# EAGLE design povsheild (EAGLE 6.5.0)
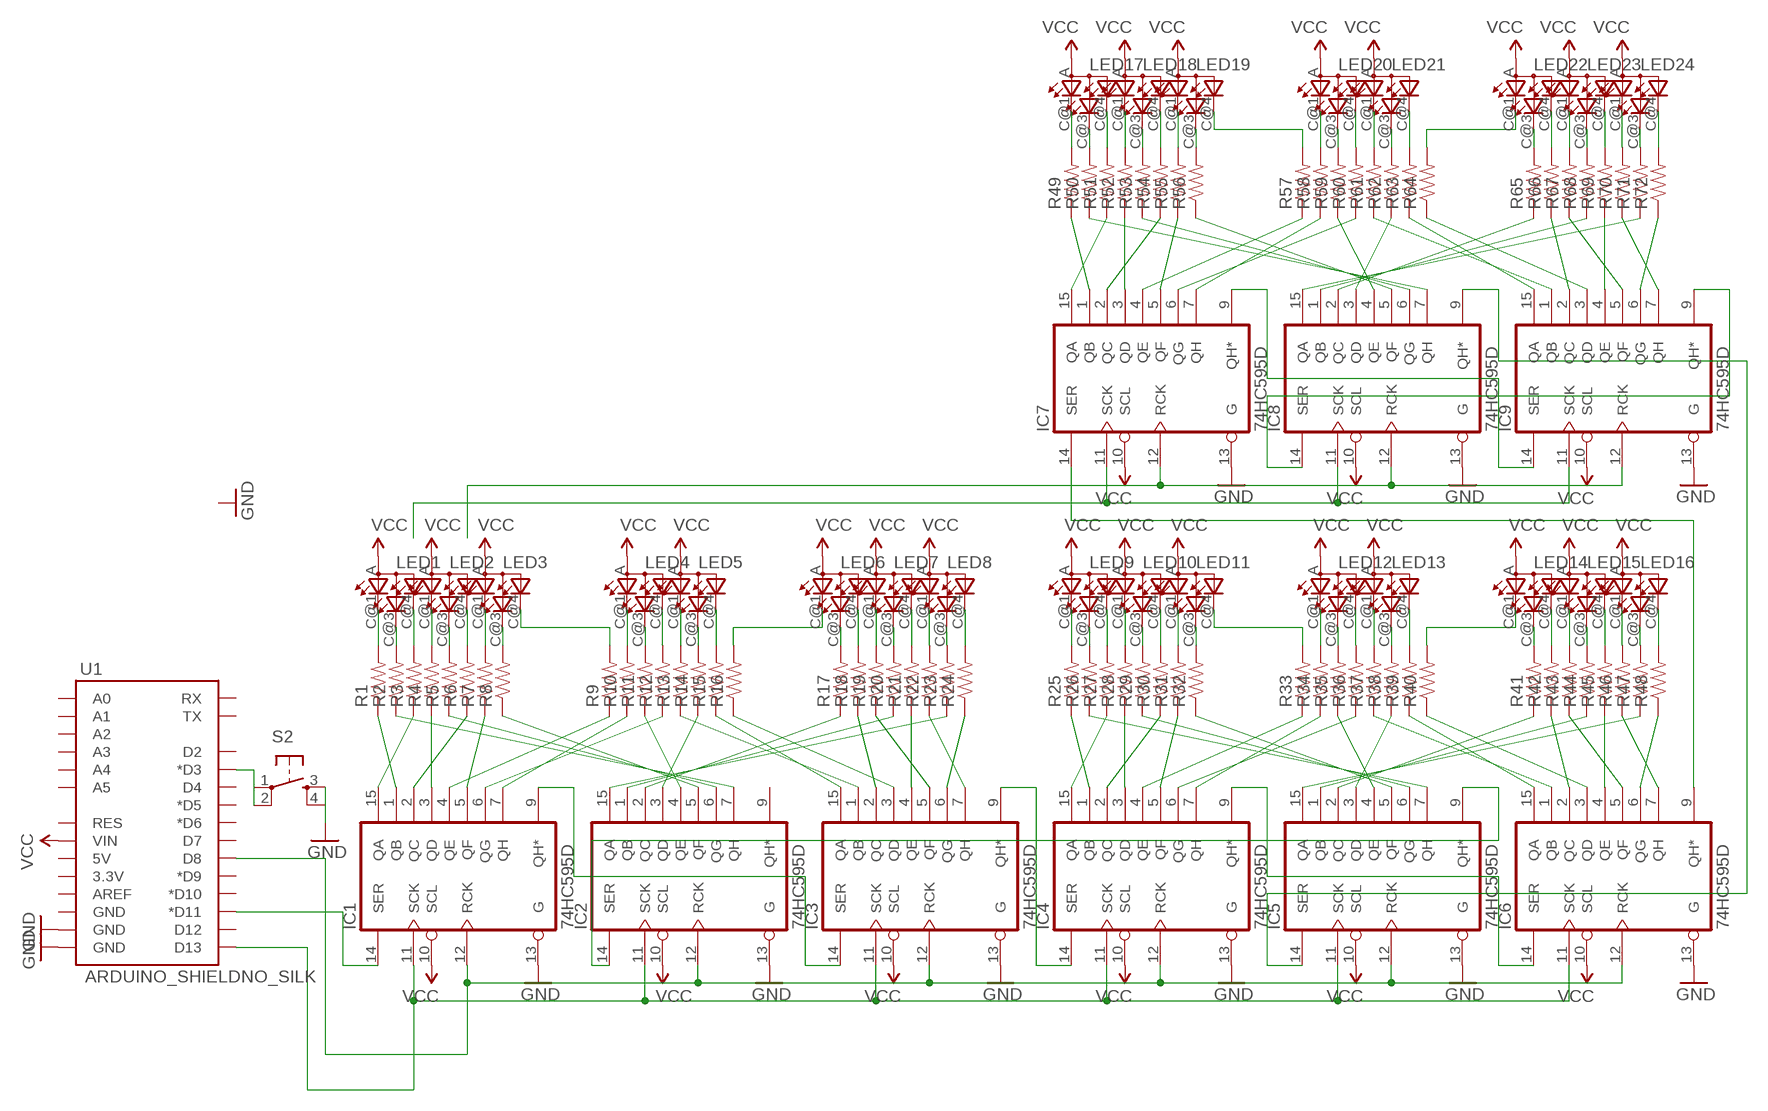
[diagram p0: schematic, sheet 1]

## Parts
IC1  74HC595D  [SO16]
IC2  74HC595D  [SO16]
IC3  74HC595D  [SO16]
IC4  74HC595D  [SO16]
IC5  74HC595D  [SO16]
IC6  74HC595D  [SO16]
IC7  74HC595D  [SO16]
IC8  74HC595D  [SO16]
IC9  74HC595D  [SO16]
LED1  TOPLED-3P-LCC-4  [P-LCC-4]
LED2  TOPLED-3P-LCC-4  [P-LCC-4]
LED3  TOPLED-3P-LCC-4  [P-LCC-4]
LED4  TOPLED-3P-LCC-4  [P-LCC-4]
LED5  TOPLED-3P-LCC-4  [P-LCC-4]
LED6  TOPLED-3P-LCC-4  [P-LCC-4]
LED7  TOPLED-3P-LCC-4  [P-LCC-4]
LED8  TOPLED-3P-LCC-4  [P-LCC-4]
LED9  TOPLED-3P-LCC-4  [P-LCC-4]
LED10  TOPLED-3P-LCC-4  [P-LCC-4]
LED11  TOPLED-3P-LCC-4  [P-LCC-4]
LED12  TOPLED-3P-LCC-4  [P-LCC-4]
LED13  TOPLED-3P-LCC-4  [P-LCC-4]
LED14  TOPLED-3P-LCC-4  [P-LCC-4]
LED15  TOPLED-3P-LCC-4  [P-LCC-4]
LED16  TOPLED-3P-LCC-4  [P-LCC-4]
LED17  TOPLED-3P-LCC-4  [P-LCC-4]
LED18  TOPLED-3P-LCC-4  [P-LCC-4]
LED19  TOPLED-3P-LCC-4  [P-LCC-4]
LED20  TOPLED-3P-LCC-4  [P-LCC-4]
LED21  TOPLED-3P-LCC-4  [P-LCC-4]
LED22  TOPLED-3P-LCC-4  [P-LCC-4]
LED23  TOPLED-3P-LCC-4  [P-LCC-4]
LED24  TOPLED-3P-LCC-4  [P-LCC-4]
R1  RESISTOR0805-RES  [0805]
R2  RESISTOR0805-RES  [0805]
R3  RESISTOR0805-RES  [0805]
R4  RESISTOR0805-RES  [0805]
R5  RESISTOR0805-RES  [0805]
R6  RESISTOR0805-RES  [0805]
R7  RESISTOR0805-RES  [0805]
R8  RESISTOR0805-RES  [0805]
R9  RESISTOR0805-RES  [0805]
R10  RESISTOR0805-RES  [0805]
R11  RESISTOR0805-RES  [0805]
R12  RESISTOR0805-RES  [0805]
R13  RESISTOR0805-RES  [0805]
R14  RESISTOR0805-RES  [0805]
R15  RESISTOR0805-RES  [0805]
R16  RESISTOR0805-RES  [0805]
R17  RESISTOR0805-RES  [0805]
R18  RESISTOR0805-RES  [0805]
R19  RESISTOR0805-RES  [0805]
R20  RESISTOR0805-RES  [0805]
R21  RESISTOR0805-RES  [0805]
R22  RESISTOR0805-RES  [0805]
R23  RESISTOR0805-RES  [0805]
R24  RESISTOR0805-RES  [0805]
R25  RESISTOR0805-RES  [0805]
R26  RESISTOR0805-RES  [0805]
R27  RESISTOR0805-RES  [0805]
R28  RESISTOR0805-RES  [0805]
R29  RESISTOR0805-RES  [0805]
R30  RESISTOR0805-RES  [0805]
R31  RESISTOR0805-RES  [0805]
R32  RESISTOR0805-RES  [0805]
R33  RESISTOR0805-RES  [0805]
R34  RESISTOR0805-RES  [0805]
R35  RESISTOR0805-RES  [0805]
R36  RESISTOR0805-RES  [0805]
R37  RESISTOR0805-RES  [0805]
R38  RESISTOR0805-RES  [0805]
R39  RESISTOR0805-RES  [0805]
R40  RESISTOR0805-RES  [0805]
R41  RESISTOR0805-RES  [0805]
R42  RESISTOR0805-RES  [0805]
R43  RESISTOR0805-RES  [0805]
R44  RESISTOR0805-RES  [0805]
R45  RESISTOR0805-RES  [0805]
R46  RESISTOR0805-RES  [0805]
R47  RESISTOR0805-RES  [0805]
R48  RESISTOR0805-RES  [0805]
R49  RESISTOR0805-RES  [0805]
R50  RESISTOR0805-RES  [0805]
R51  RESISTOR0805-RES  [0805]
R52  RESISTOR0805-RES  [0805]
R53  RESISTOR0805-RES  [0805]
R54  RESISTOR0805-RES  [0805]
R55  RESISTOR0805-RES  [0805]
R56  RESISTOR0805-RES  [0805]
R57  RESISTOR0805-RES  [0805]
R58  RESISTOR0805-RES  [0805]
R59  RESISTOR0805-RES  [0805]
R60  RESISTOR0805-RES  [0805]
R61  RESISTOR0805-RES  [0805]
R62  RESISTOR0805-RES  [0805]
R63  RESISTOR0805-RES  [0805]
R64  RESISTOR0805-RES  [0805]
R65  RESISTOR0805-RES  [0805]
R66  RESISTOR0805-RES  [0805]
R67  RESISTOR0805-RES  [0805]
R68  RESISTOR0805-RES  [0805]
R69  RESISTOR0805-RES  [0805]
R70  RESISTOR0805-RES  [0805]
R71  RESISTOR0805-RES  [0805]
R72  RESISTOR0805-RES  [0805]
S2  TAC_SWITCHSMD  [TACTILE_SWITCH_SMD]
U1  ARDUINO_SHIELDNO_SILK  [DUEMILANOVE_VIAS]

## Nets
GND: IC1.13(G) IC2.13(G) IC3.13(G) IC4.13(G) IC5.13(G) IC6.13(G) IC7.13(G) IC8.13(G) IC9.13(G) S2.3 S2.4 U1.GND@0(GND) U1.GND@1(GND)
LATCH: IC1.12(RCK) IC2.12(RCK) IC3.12(RCK) IC4.12(RCK) IC5.12(RCK) IC6.12(RCK) IC7.12(RCK) IC8.12(RCK) IC9.12(RCK) U1.D8
N$1: IC1.15(QA) R3.1
N$2: IC1.1(QB) R1.1
N$3: IC1.2(QC) R6.1
N$4: IC1.3(QD) R4.1
N$5: IC1.4(QE) R9.1
N$6: IC1.5(QF) R7.1
N$7: IC1.6(QG) R12.1
N$8: IC1.7(QH) R10.1
N$9: LED1.C@1(CRED) R1.2
N$10: LED1.C@3(CBLUE) R2.2
N$11: LED1.C@4(CGREEN) R3.2
N$12: LED2.C@1(CRED) R4.2
N$13: LED2.C@3(CBLUE) R5.2
N$14: LED2.C@4(CGREEN) R6.2
N$15: LED3.C@1(CRED) R7.2
N$16: LED3.C@3(CBLUE) R8.2
N$17: LED3.C@4(CGREEN) R9.2
N$18: LED4.C@1(CRED) R10.2
N$19: IC3.15(QA) R15.1
N$20: IC3.1(QB) R13.1
N$21: LED4.C@3(CBLUE) R11.2
N$22: IC3.2(QC) R18.1
N$23: IC3.3(QD) R16.1
N$24: IC3.4(QE) R21.1
N$25: IC3.5(QF) R19.1
N$26: IC3.6(QG) R24.1
N$27: IC3.7(QH) R22.1
N$28: LED4.C@4(CGREEN) R12.2
N$29: LED5.C@1(CRED) R13.2
N$30: LED5.C@3(CBLUE) R14.2
N$31: LED5.C@4(CGREEN) R15.2
N$32: LED6.C@1(CRED) R16.2
N$33: LED6.C@3(CBLUE) R17.2
N$34: LED6.C@4(CGREEN) R18.2
N$35: IC2.15(QA) R23.1
N$36: IC2.1(QB) R20.1
N$37: LED7.C@1(CRED) R19.2
N$38: IC2.2(QC) R17.1
N$39: LED7.C@3(CBLUE) R20.2
N$40: IC2.3(QD) R14.1
N$41: LED7.C@4(CGREEN) R21.2
N$42: IC2.4(QE) R11.1
N$43: IC2.5(QF) R8.1
N$44: IC2.6(QG) R5.1
N$45: IC2.7(QH) R2.1
N$46: LED8.C@1(CRED) R22.2
N$47: LED8.C@3(CBLUE) R23.2
N$48: LED8.C@4(CGREEN) R24.2
N$49: IC4.15(QA) R27.1
N$50: IC4.1(QB) R25.1
N$51: IC4.2(QC) R30.1
N$52: IC4.3(QD) R28.1
N$53: IC4.4(QE) R33.1
N$54: IC4.5(QF) R31.1
N$55: IC4.6(QG) R36.1
N$56: IC4.7(QH) R34.1
N$57: LED9.C@1(CRED) R25.2
N$58: LED9.C@3(CBLUE) R26.2
N$59: LED9.C@4(CGREEN) R27.2
N$60: LED10.C@1(CRED) R28.2
N$61: LED10.C@3(CBLUE) R29.2
N$62: LED10.C@4(CGREEN) R30.2
N$63: LED11.C@1(CRED) R31.2
N$64: LED11.C@3(CBLUE) R32.2
N$65: LED11.C@4(CGREEN) R33.2
N$66: LED12.C@1(CRED) R34.2
N$67: IC5.15(QA) R47.1
N$68: IC5.1(QB) R44.1
N$69: LED12.C@3(CBLUE) R35.2
N$70: IC5.2(QC) R41.1
N$71: IC5.3(QD) R38.1
N$72: IC5.4(QE) R35.1
N$73: IC5.5(QF) R32.1
N$74: IC5.6(QG) R29.1
N$75: IC5.7(QH) R26.1
N$76: LED12.C@4(CGREEN) R36.2
N$77: LED13.C@1(CRED) R37.2
N$78: LED13.C@3(CBLUE) R38.2
N$79: LED13.C@4(CGREEN) R39.2
N$80: LED14.C@1(CRED) R40.2
N$81: LED14.C@3(CBLUE) R41.2
N$82: LED14.C@4(CGREEN) R42.2
N$83: IC6.15(QA) R39.1
N$84: IC6.1(QB) R37.1
N$85: LED15.C@1(CRED) R43.2
N$86: IC6.2(QC) R42.1
N$87: LED15.C@3(CBLUE) R44.2
N$88: IC6.3(QD) R40.1
N$89: LED15.C@4(CGREEN) R45.2
N$90: IC6.4(QE) R45.1
N$91: IC6.5(QF) R43.1
N$92: IC6.6(QG) R48.1
N$93: IC6.7(QH) R46.1
N$94: LED16.C@1(CRED) R46.2
N$95: LED16.C@3(CBLUE) R47.2
N$96: LED16.C@4(CGREEN) R48.2
N$105: LED17.C@1(CRED) R49.2
N$106: LED17.C@3(CBLUE) R50.2
N$107: LED17.C@4(CGREEN) R51.2
N$108: LED18.C@1(CRED) R52.2
N$109: LED18.C@3(CBLUE) R53.2
N$110: LED18.C@4(CGREEN) R54.2
N$111: LED19.C@1(CRED) R55.2
N$112: LED19.C@3(CBLUE) R56.2
N$113: LED19.C@4(CGREEN) R57.2
N$114: LED20.C@1(CRED) R58.2
N$117: LED20.C@3(CBLUE) R59.2
N$124: LED20.C@4(CGREEN) R60.2
N$125: LED21.C@1(CRED) R61.2
N$126: LED21.C@3(CBLUE) R62.2
N$127: LED21.C@4(CGREEN) R63.2
N$128: LED22.C@1(CRED) R64.2
N$129: LED22.C@3(CBLUE) R65.2
N$130: LED22.C@4(CGREEN) R66.2
N$133: LED23.C@1(CRED) R67.2
N$135: LED23.C@3(CBLUE) R68.2
N$137: LED23.C@4(CGREEN) R69.2
N$142: LED24.C@1(CRED) R70.2
N$143: LED24.C@3(CBLUE) R71.2
N$144: LED24.C@4(CGREEN) R72.2
N$145: IC7.15(QA) R51.1
N$146: IC7.1(QB) R49.1
N$147: IC7.2(QC) R54.1
N$148: IC7.3(QD) R52.1
N$149: IC7.4(QE) R57.1
N$150: IC7.5(QF) R55.1
N$151: IC7.6(QG) R60.1
N$152: IC7.7(QH) R58.1
N$163: IC8.15(QA) R71.1
N$164: IC8.1(QB) R68.1
N$166: IC8.2(QC) R65.1
N$167: IC8.3(QD) R62.1
N$168: IC8.4(QE) R59.1
N$169: IC8.5(QF) R56.1
N$170: IC8.6(QG) R53.1
N$171: IC8.7(QH) R50.1
N$179: IC9.15(QA) R63.1
N$180: IC9.1(QB) R61.1
N$182: IC9.2(QC) R66.1
N$184: IC9.3(QD) R64.1
N$186: IC9.4(QE) R69.1
N$187: IC9.5(QF) R67.1
N$188: IC9.6(QG) R72.1
N$189: IC9.7(QH) R70.1
N$193: IC1.9(QH*) IC3.14(SER)
N$194: IC3.9(QH*) IC4.14(SER)
N$195: IC4.9(QH*) IC6.14(SER)
N$196: IC6.9(QH*) IC7.14(SER)
N$197: IC7.9(QH*) IC9.14(SER)
N$201: IC2.14(SER) IC5.9(QH*)
N$202: IC5.14(SER) IC8.9(QH*)
N$203: IC8.14(SER) IC9.9(QH*)
N$205: IC1.14(SER) U1.D11(*D11)
N$206: S2.1 S2.2 U1.D3(*D3)
SCK: IC1.11(SCK) IC2.11(SCK) IC3.11(SCK) IC4.11(SCK) IC5.11(SCK) IC6.11(SCK) IC7.11(SCK) IC8.11(SCK) IC9.11(SCK) U1.D13
VCC: IC1.10(SCL) IC2.10(SCL) IC3.10(SCL) IC4.10(SCL) IC5.10(SCL) IC6.10(SCL) IC7.10(SCL) IC8.10(SCL) IC9.10(SCL) LED1.A(A2) LED2.A(A2) LED3.A(A2) LED4.A(A2) LED5.A(A2) LED6.A(A2) LED7.A(A2) LED8.A(A2) LED9.A(A2) LED10.A(A2) LED11.A(A2) LED12.A(A2) LED13.A(A2) LED14.A(A2) LED15.A(A2) LED16.A(A2) LED17.A(A2) LED18.A(A2) LED19.A(A2) LED20.A(A2) LED21.A(A2) LED22.A(A2) LED23.A(A2) LED24.A(A2) U1.VIN
Unconnected: IC2.9(QH*) U1.3.3V U1.5V U1.A0 U1.A1 U1.A2 U1.A3 U1.A4 U1.A5 U1.AREF U1.D2 U1.D4 U1.D5(*D5) U1.D6(*D6) U1.D7 U1.D9(*D9) U1.D10(*D10) U1.D12 U1.GND@2(GND) U1.RES U1.RX U1.TX

## Power pins joined to a net without a drawn wire
GND: IC1.8(GND) IC2.8(GND) IC3.8(GND) IC4.8(GND) IC5.8(GND) IC6.8(GND) IC7.8(GND) IC8.8(GND) IC9.8(GND)
VCC: IC1.16(VCC) IC2.16(VCC) IC3.16(VCC) IC4.16(VCC) IC5.16(VCC) IC6.16(VCC) IC7.16(VCC) IC8.16(VCC) IC9.16(VCC)

## Library data of the parts
IC1-IC9 = 74xx-eu:74*595: 8-bit SHIFT REGISTER, output latch
LED1-LED24 = led:TOPLED-3: OSRAM - Hyper Multi TOPLED® (RGB) LB E673, LV E673, LT E673 - Power TOPLED® Enhanced optical Power LED (HOP2000) LS E67B, LA E67B, LO E67B, LY E67B - Hyper Multi TOPLED® Enhanced optical Power LED (HOP2000 / ATON®) LATB T66B - Hyper Multi TOPLED® Hyper-Bright LED LATB T686 Source: http://www.osram.convergy.de/
R1-R72 = SparkFun-Resistors:RESISTOR: Resistor Basic schematic elements and footprints for 0603, 1206, and PTH resistors.
S2 = SparkFun-Electromechanical:TAC_SWITCH: Momentary Switch Button commonly used for reset or general input. Spark Fun Electronics SKU : COM-00097 SMT- SWCH-08247; PROD_ID: SWCH-08247
U1 = SparkFun-Boards:ARDUINO_SHIELD: Arduino shield footprint

## Board
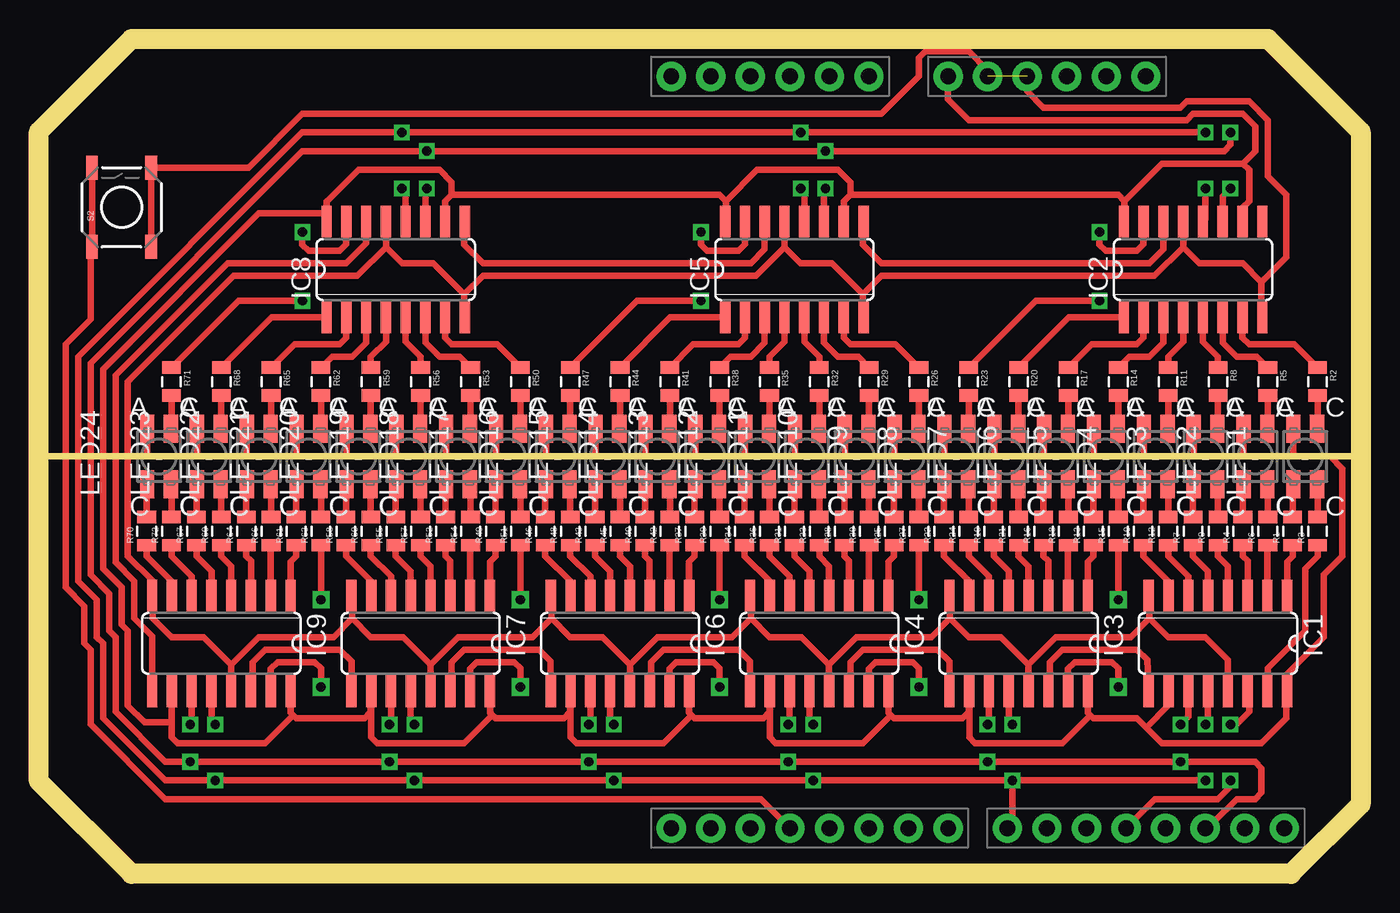
[diagram p1: board, top side]
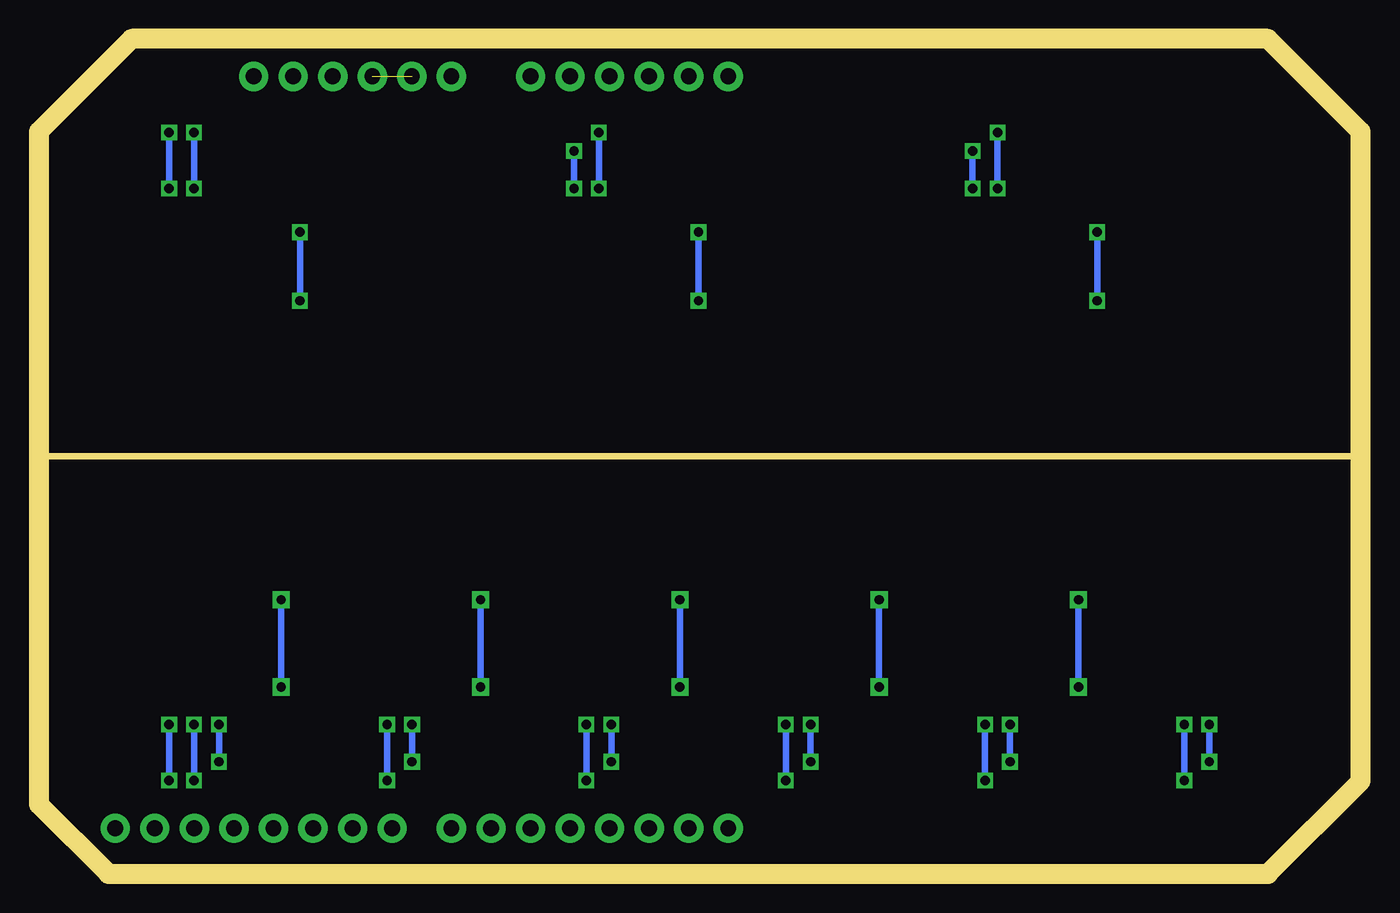
[diagram p2: board, bottom side, seen from below]

Size 84.88 x 53.6 mm. Coordinates in mm from the lower left corner, seen from the top.
Outline: 0,26.8 84.88,26.8
Outline: 84.88,26.8 84.88,47.65 78.92,53.6 5.96,53.6 0,47.65 0,26.8
Outline: 84.88,26.8 84.88,4.47 80.41,0 5.96,0 0,5.96 0,26.8
Copper layers (1*16): Top 0.035mm / dielectric 1.5mm / Bottom 0.035mm
Design rules "default": minimum track width 10mil, minimum drill 24mil, track to track 8mil, track to pad 8mil, pad to pad 8mil, via to via 8mil, smd to smd 8mil, copper to edge 40mil, drill to drill 8mil, minimum pad ring 10mil, minimum via ring 8mil, stop-mask expansion 4mil, vias tented up to drill 0mil, thermal gap 10mil
Milling: 8 lines

### Footprints (pad centres in the part's own frame; a part is rotated, then mirrored left to right if it is on the bottom)
SO16 = smd 0.66 x 2.032: 1 -4.445,-3.073; 2 -3.175,-3.073; 3 -1.905,-3.073; 4 -0.635,-3.073; 5 0.635,-3.073; 6 1.905,-3.073; 7 3.175,-3.073; 8 4.445,-3.073; 9 4.445,3.073; 10 3.175,3.073; 11 1.905,3.073; 12 0.635,3.073; 13 -0.635,3.073; 14 -1.905,3.073; 15 -3.175,3.073; 16 -4.445,3.073
P-LCC-4 = smd 0.914 x 1.778: A -0.762,1.778; C@1 -0.762,-1.778; C@3 0.762,1.778; C@4 0.762,-1.778
0805 = smd 0.8 x 1.2: 1 -0.9,0; 2 0.9,0
TACTILE_SWITCH_SMD = smd 1.524 x 0.762: 1 -2.54,1.905; 2 2.54,1.905; 3 -2.54,-1.905; 4 2.54,-1.905
DUEMILANOVE_VIAS = drill 1.016 pad 1.88: 3.3V 50.8,13.97; 5V 50.8,16.51; A0 50.8,29.21; A1 50.8,31.75; A2 50.8,34.29; A3 50.8,36.83; A4 50.8,39.37; A5 50.8,41.91; AREF 2.54,2.54; D2 2.54,36.83; D3 2.54,34.29; D4 2.54,31.75; D5 2.54,29.21; D6 2.54,26.67; D7 2.54,24.13; D8 2.54,20.32; D9 2.54,17.78; D10 2.54,15.24; D11 2.54,12.7; D12 2.54,10.16; D13 2.54,7.62; GND@0 50.8,19.05; GND@1 50.8,21.59; GND@2 2.54,5.08; RES 50.8,11.43; RX 2.54,41.91; TX 2.54,39.37; VIN 50.8,24.13

### Placement (x,y rotation side)
IC1  75.72,14.8 180 top
IC2  74.11,38.8 0 top
IC3  62.92,14.8 180 top
IC4  50.12,14.8 180 top
IC5  48.52,38.8 0 top
IC6  37.31,14.8 180 top
IC7  24.52,14.8 180 top
IC8  22.92,38.8 0 top
IC9  11.72,14.8 180 top
LED1  81.31,26.8 0 top
LED2  78.11,26.8 0 top
LED3  74.92,26.8 0 top
LED4  71.72,26.8 0 top
LED5  68.52,26.8 0 top
LED6  65.31,26.8 0 top
LED7  62.11,26.8 0 top
LED8  58.92,26.8 0 top
LED9  55.72,26.8 0 top
LED10  52.52,26.8 0 top
LED11  49.31,26.8 0 top
LED12  46.12,26.8 0 top
LED13  42.92,26.8 0 top
LED14  39.72,26.8 0 top
LED15  36.52,26.8 0 top
LED16  33.31,26.8 0 top
LED17  30.12,26.8 0 top
LED18  26.92,26.8 0 top
LED19  23.71,26.8 0 top
LED20  20.52,26.8 0 top
LED21  17.32,26.8 0 top
LED22  14.12,26.8 0 top
LED23  10.92,26.8 0 top
LED24  7.71,26.8 0 top
R1  80.52,22 90 top
R2  82.11,31.6 270 top
R3  82.11,22 90 top
R4  77.31,22 90 top
R5  78.92,31.6 270 top
R6  78.92,22 90 top
R7  74.11,22 90 top
R8  75.72,31.6 270 top
R9  75.72,22 90 top
R10  70.92,22 90 top
R11  72.52,31.6 270 top
R12  72.52,22 90 top
R13  67.72,22 90 top
R14  69.31,31.6 270 top
R15  69.31,22 90 top
R16  64.52,22 90 top
R17  66.11,31.6 270 top
R18  66.11,22 90 top
R19  61.31,22 90 top
R20  62.92,31.6 270 top
R21  62.92,22 90 top
R22  58.11,22 90 top
R23  59.72,31.6 270 top
R24  59.72,22 90 top
R25  54.92,22 90 top
R26  56.52,31.6 270 top
R27  56.52,22 90 top
R28  51.72,22 90 top
R29  53.31,31.6 270 top
R30  53.31,22 90 top
R31  48.52,22 90 top
R32  50.12,31.6 270 top
R33  50.12,22 90 top
R34  45.31,22 90 top
R35  46.92,31.6 270 top
R36  46.92,22 90 top
R37  42.12,22 90 top
R38  43.72,31.6 270 top
R39  43.72,22 90 top
R40  38.91,22 90 top
R41  40.52,31.6 270 top
R42  40.52,22 90 top
R43  35.72,22 90 top
R44  37.31,31.6 270 top
R45  37.31,22 90 top
R46  32.52,22 90 top
R47  34.12,31.6 270 top
R48  34.12,22 90 top
R49  29.32,22 90 top
R50  30.91,31.6 270 top
R51  30.91,22 90 top
R52  26.12,22 90 top
R53  27.71,31.6 270 top
R54  27.71,22 90 top
R55  22.92,22 90 top
R56  24.52,31.6 270 top
R57  24.52,22 90 top
R58  19.72,22 90 top
R59  21.32,31.6 270 top
R60  21.32,22 90 top
R61  16.52,22 90 top
R62  18.12,31.6 270 top
R63  18.12,22 90 top
R64  13.32,22 90 top
R65  14.92,31.6 270 top
R66  14.92,22 90 top
R67  10.12,22 90 top
R68  11.72,31.6 270 top
R69  11.72,22 90 top
R70  6.92,22 90 top
R71  8.52,31.6 270 top
R72  8.52,22 90 top
S2  5.32,42.8 90 top
U1  82.52,0.4 90 top

### Tracks (layer width: path | path; a pad name or v marks a point on that pad's centre or on a via)
GND  (1 unrouted)
  Top 0.406: IC9.13 12.35,13.44 | 12.35,13.44 14.12,15.2 18.91,15.2 20.12,16.4 | 20.12,16.4 20.12,17.83 IC7.8 | IC7.13 25.15,13.44 | 25.15,13.44 26.92,15.2 31.72,15.2 32.91,16.4 | 32.91,16.4 32.91,17.83 IC6.8 | IC6.13 37.95,13.44 | 37.95,13.44 39.72,15.2 44.52,15.2 45.72,16.4 | 45.72,16.4 45.72,17.83 IC4.8 | IC4.13 50.75,13.44 | 50.75,13.44 52.52,15.2 57.31,15.2 58.52,16.4 | 58.52,16.4 58.52,17.83 IC3.8 | IC3.13 63.55,13.44 | 63.55,13.44 65.31,15.2 70.11,15.2 71.31,16.4 | 71.31,16.4 71.31,17.83 IC1.8 | 12.35,13.44 10.59,15.2 8.52,15.2 7.32,16.4 7.32,17.83 IC9.8 7.27,18.84 5.71,20.4 5.71,31.6 12.52,38.4 20.45,38.4 22.28,40.23 | 20.12,16.4 21.32,15.2 23.39,15.2 25.15,13.44 | 32.91,16.4 34.12,15.2 36.19,15.2 37.95,13.44 | 45.72,16.4 46.92,15.2 48.98,15.2 50.75,13.44 | 58.52,16.4 59.72,15.2 61.78,15.2 63.55,13.44 | 71.31,16.4 72.52,15.2 74.92,15.2 76.35,13.77 IC1.13 | IC8.13 22.28,40.23 | 22.28,40.23 23.32,39.2 25.32,39.2 27.32,37.2 | 27.32,37.2 27.32,35.77 IC8.8 | IC5.13 47.88,40.23 | 47.88,40.23 48.92,39.2 50.92,39.2 52.92,37.2 | 52.92,37.2 52.92,35.77 IC5.8 | IC2.13 73.48,40.23 | 73.48,40.23 74.52,39.2 77.31,39.2 78.52,38 | 78.52,38 78.52,35.77 IC2.8 | 27.32,37.2 28.52,38.4 46.05,38.4 47.88,40.23 | 52.92,37.2 54.12,38.4 71.64,38.4 73.48,40.23 | U1.GND@0 63.47,50.25 64.52,49.2 73.31,49.2 73.72,49.6 77.72,49.6 78.92,48.4 78.92,44.8 80.11,43.6 80.11,39.6 78.52,38 | U1.GND@1 60.92,51.59 59.72,52.8 56.92,52.8 56.52,52.4 56.52,51.2 54.12,48.8 16.91,48.8 13.46,45.34 S2.4 S2.3
LATCH  (via drill 0.6)
  Top 0.406: v62.52,6 v49.72,6 v36.91,6 v24.12,6 v11.32,6 8.12,6 4.12,10 4.12,14.8 3.71,15.2 3.71,17.6 2.52,18.8 2.52,33.2 16.91,47.6 v23.32,47.6 v48.92,47.6 v74.92,47.6 | v62.52,6 v74.92,6 | IC9.12 11.08,9.84 v11.32,9.6 | IC7.12 23.88,9.84 v24.12,9.6 | IC6.12 36.68,9.84 v36.91,9.6 | IC4.12 49.48,9.84 v49.72,9.6 | IC3.12 62.28,9.84 v62.52,9.6 | v74.92,9.6 75.08,9.84 IC1.12 | IC2.12 74.92,42.04 v74.92,44 | IC8.12 23.55,43.77 v23.32,44 | IC5.12 49.15,43.77 v48.92,44 | v62.52,6 62.52,3.26 U1.D8
  Bottom 0.406: v11.32,9.6 v11.32,6 | v24.12,9.6 v24.12,6 | v36.91,9.6 v36.91,6 | v49.72,9.6 v49.72,6 | v62.52,9.6 v62.52,6 | v74.92,6 v74.92,9.6 | v74.92,44 v74.92,47.6 | v23.32,44 v23.32,47.6 | v48.92,44 v48.92,47.6
N$1
  Top 0.406: R3.1 82.11,20.4 81.31,19.6 81.31,15.6 78.92,13.2 78.92,11.75 IC1.15
N$2
  Top 0.406: IC1.1 80.16,20.05 80.52,20.4 R1.1
N$3
  Top 0.406: IC1.2 78.89,21.07 R6.1
N$4
  Top 0.406: IC1.3 77.62,20.09 77.31,20.4 R4.1
N$5
  Top 0.406: IC1.4 76.35,19.77 75.72,20.4 R9.1
N$6
  Top 0.406: IC1.5 75.08,19.43 74.11,20.4 R7.1
N$7
  Top 0.406: IC1.6 73.81,19.11 72.52,20.4 R12.1
N$8
  Top 0.406: IC1.7 72.54,18.77 70.92,20.4 R10.1
N$9
  Top 0.406: LED1.C@1 80.52,25.02 R1.2
N$10
  Top 0.406: LED1.C@3 82.11,28.58 R2.2
N$11
  Top 0.406: LED1.C@4 82.11,25.02 R3.2
N$12
  Top 0.406: LED2.C@1 77.31,25.02 R4.2
N$13
  Top 0.406: LED2.C@3 78.92,28.58 R5.2
N$14
  Top 0.406: LED2.C@4 78.92,25.02 R6.2
N$15
  Top 0.406: LED3.C@1 74.11,25.02 R7.2
N$16
  Top 0.406: LED3.C@3 75.72,28.58 R8.2
N$17
  Top 0.406: LED3.C@4 75.72,25.02 R9.2
N$18
  Top 0.406: LED4.C@1 70.92,25.02 R10.2
N$19  (via drill 0.6 pad 1.1)
  Top 0.406: IC3.15 66.09,13.18 66.52,13.6 68.92,13.6 69.31,13.2 v69.31,12 | v69.31,17.6 R15.1
  Bottom 0.406: v69.31,12 v69.31,17.6
N$20
  Top 0.406: IC3.1 67.36,20.05 67.72,20.4 R13.1
N$21
  Top 0.406: LED4.C@3 72.52,28.58 R11.2
N$22
  Top 0.406: IC3.2 66.09,21.07 R18.1
N$23
  Top 0.406: IC3.3 64.82,20.09 64.52,20.4 R16.1
N$24
  Top 0.406: IC3.4 63.55,19.77 62.92,20.4 R21.1
N$25
  Top 0.406: IC3.5 62.28,19.43 61.31,20.4 R19.1
N$26
  Top 0.406: IC3.6 61.01,19.11 59.72,20.4 R24.1
N$27
  Top 0.406: IC3.7 59.74,18.77 58.11,20.4 R22.1
N$28
  Top 0.406: LED4.C@4 72.52,25.02 R12.2
N$29
  Top 0.406: LED5.C@1 67.72,25.02 R13.2
N$30
  Top 0.406: LED5.C@3 69.31,28.58 R14.2
N$31
  Top 0.406: LED5.C@4 69.31,25.02 R15.2
N$32
  Top 0.406: LED6.C@1 64.52,25.02 R16.2
N$33
  Top 0.406: LED6.C@3 66.11,28.58 R17.2
N$34
  Top 0.406: LED6.C@4 66.11,25.02 R18.2
N$35  (via drill 0.6)
  Top 0.406: IC2.15 70.94,40.42 70.52,40 68.52,40 68.11,40.4 v68.11,41.2 | v68.11,36.8 64.02,36.8 R23.1
  Bottom 0.406: v68.11,41.2 v68.11,36.8
N$36
  Top 0.406: IC2.1 66.14,35.73 R20.1
N$37
  Top 0.406: LED7.C@1 61.31,25.02 R19.2
N$38
  Top 0.406: IC2.2 70.94,34.42 70.52,34 67.61,34 R17.1
N$39
  Top 0.406: LED7.C@3 62.92,28.58 R20.2
N$40
  Top 0.406: IC2.3 72.21,34.09 71.31,33.2 70.02,33.2 R14.1
N$41
  Top 0.406: LED7.C@4 62.92,25.02 R21.2
N$42
  Top 0.406: IC2.4 73.48,34.16 72.52,33.2 R11.1
N$43
  Top 0.406: IC2.5 74.75,34.16 75.72,33.2 R8.1
N$44
  Top 0.406: IC2.6 76.02,34.09 76.92,33.2 78.22,33.2 R5.1
N$45
  Top 0.406: IC2.7 77.29,34.42 77.72,34 80.61,34 R2.1
N$46
  Top 0.406: LED8.C@1 58.11,25.02 R22.2
N$47
  Top 0.406: LED8.C@3 59.72,28.58 R23.2
N$48
  Top 0.406: LED8.C@4 59.72,25.02 R24.2
N$49  (via drill 0.6 pad 1.1)
  Top 0.406: IC4.15 53.29,13.18 53.72,13.6 56.12,13.6 56.52,13.2 v56.52,12 | v56.52,17.6 R27.1
  Bottom 0.406: v56.52,12 v56.52,17.6
N$50
  Top 0.406: IC4.1 54.56,20.05 54.92,20.4 R25.1
N$51
  Top 0.406: IC4.2 53.29,21.07 R30.1
N$52
  Top 0.406: IC4.3 52.02,20.09 51.72,20.4 R28.1
N$53
  Top 0.406: IC4.4 50.75,19.77 50.12,20.4 R33.1
N$54
  Top 0.406: IC4.5 49.48,19.43 48.52,20.4 R31.1
N$55
  Top 0.406: IC4.6 48.21,19.11 46.92,20.4 R36.1
N$56
  Top 0.406: IC4.7 46.94,18.77 45.31,20.4 R34.1
N$57
  Top 0.406: LED9.C@1 54.92,25.02 R25.2
N$58
  Top 0.406: LED9.C@3 56.52,28.58 R26.2
N$59
  Top 0.406: LED9.C@4 56.52,25.02 R27.2
N$60
  Top 0.406: LED10.C@1 51.72,25.02 R28.2
N$61
  Top 0.406: LED10.C@3 53.31,28.58 R29.2
N$62
  Top 0.406: LED10.C@4 53.31,25.02 R30.2
N$63
  Top 0.406: LED11.C@1 48.52,25.02 R31.2
N$64
  Top 0.406: LED11.C@3 50.12,28.58 R32.2
N$65
  Top 0.406: LED11.C@4 50.12,25.02 R33.2
N$66
  Top 0.406: LED12.C@1 45.31,25.02 R34.2
N$67  (via drill 0.6)
  Top 0.406: IC5.15 45.34,40.42 44.92,40 42.92,40 42.52,40.4 v42.52,41.2 | v42.52,36.8 38.41,36.8 R47.1
  Bottom 0.406: v42.52,41.2 v42.52,36.8
N$68
  Top 0.406: IC5.1 40.54,35.73 R44.1
N$69
  Top 0.406: LED12.C@3 46.92,28.58 R35.2
N$70
  Top 0.406: IC5.2 45.34,34.42 44.92,34 42.02,34 R41.1
N$71
  Top 0.406: IC5.3 46.61,34.09 45.72,33.2 44.42,33.2 R38.1
N$72
  Top 0.406: IC5.4 47.88,34.16 46.92,33.2 R35.1
N$73
  Top 0.406: IC5.5 49.15,34.16 50.12,33.2 R32.1
N$74
  Top 0.406: IC5.6 50.42,34.09 51.31,33.2 52.62,33.2 R29.1
N$75
  Top 0.406: IC5.7 51.69,34.42 52.12,34 55.02,34 R26.1
N$76
  Top 0.406: LED12.C@4 46.92,25.02 R36.2
N$77
  Top 0.406: LED13.C@1 42.12,25.02 R37.2
N$78
  Top 0.406: LED13.C@3 43.72,28.58 R38.2
N$79
  Top 0.406: LED13.C@4 43.72,25.02 R39.2
N$80
  Top 0.406: LED14.C@1 38.91,25.02 R40.2
N$81
  Top 0.406: LED14.C@3 40.52,28.58 R41.2
N$82
  Top 0.406: LED14.C@4 40.52,25.02 R42.2
N$83  (via drill 0.6 pad 1.1)
  Top 0.406: IC6.15 40.49,13.18 40.91,13.6 43.31,13.6 43.72,13.2 v43.72,12 | v43.72,17.6 R39.1
  Bottom 0.406: v43.72,12 v43.72,17.6
N$84
  Top 0.406: IC6.1 41.76,20.05 42.12,20.4 R37.1
N$85
  Top 0.406: LED15.C@1 35.72,25.02 R43.2
N$86
  Top 0.406: IC6.2 40.49,21.07 R42.1
N$87
  Top 0.406: LED15.C@3 37.31,28.58 R44.2
N$88
  Top 0.406: IC6.3 39.22,20.09 38.91,20.4 R40.1
N$89
  Top 0.406: LED15.C@4 37.31,25.02 R45.2
N$90
  Top 0.406: IC6.4 37.95,19.77 37.31,20.4 R45.1
N$91
  Top 0.406: IC6.5 36.68,19.43 35.72,20.4 R43.1
N$92
  Top 0.406: IC6.6 35.41,19.11 34.12,20.4 R48.1
N$93
  Top 0.406: IC6.7 34.14,18.77 32.52,20.4 R46.1
N$94
  Top 0.406: LED16.C@1 32.52,25.02 R46.2
N$95
  Top 0.406: LED16.C@3 34.12,28.58 R47.2
N$96
  Top 0.406: LED16.C@4 34.12,25.02 R48.2
N$105
  Top 0.406: LED17.C@1 29.32,25.02 R49.2
N$106
  Top 0.406: LED17.C@3 30.91,28.58 R50.2
N$107
  Top 0.406: LED17.C@4 30.91,25.02 R51.2
N$108
  Top 0.406: LED18.C@1 26.12,25.02 R52.2
N$109
  Top 0.406: LED18.C@3 27.71,28.58 R53.2
N$110
  Top 0.406: LED18.C@4 27.71,25.02 R54.2
N$111
  Top 0.406: LED19.C@1 22.92,25.02 R55.2
N$112
  Top 0.406: LED19.C@3 24.52,28.58 R56.2
N$113
  Top 0.406: LED19.C@4 24.52,25.02 R57.2
N$114
  Top 0.406: LED20.C@1 19.72,25.02 R58.2
N$117
  Top 0.406: LED20.C@3 21.32,28.58 R59.2
N$124
  Top 0.406: LED20.C@4 21.32,25.02 R60.2
N$125
  Top 0.406: LED21.C@1 16.52,25.02 R61.2
N$126
  Top 0.406: LED21.C@3 18.12,28.58 R62.2
N$127
  Top 0.406: LED21.C@4 18.12,25.02 R63.2
N$128
  Top 0.406: LED22.C@1 13.32,25.02 R64.2
N$129
  Top 0.406: LED22.C@3 14.92,28.58 R65.2
N$130
  Top 0.406: LED22.C@4 14.92,25.02 R66.2
N$133
  Top 0.406: LED23.C@1 10.12,25.02 R67.2
N$135
  Top 0.406: LED23.C@3 11.72,28.58 R68.2
N$137
  Top 0.406: LED23.C@4 11.72,25.02 R69.2
N$142
  Top 0.406: LED24.C@1 6.92,25.02 R70.2
N$143
  Top 0.406: LED24.C@3 8.52,28.58 R71.2
N$144
  Top 0.406: LED24.C@4 8.52,25.02 R72.2
N$145  (via drill 0.6 pad 1.1)
  Top 0.406: IC7.15 27.69,13.18 28.12,13.6 30.52,13.6 30.91,13.2 v30.91,12 | v30.91,17.6 R51.1
  Bottom 0.406: v30.91,12 v30.91,17.6
N$146
  Top 0.406: IC7.1 28.96,20.05 29.32,20.4 R49.1
N$147
  Top 0.406: IC7.2 27.69,21.07 R54.1
N$148
  Top 0.406: IC7.3 26.42,20.09 26.12,20.4 R52.1
N$149
  Top 0.406: IC7.4 25.15,19.77 24.52,20.4 R57.1
N$150
  Top 0.406: IC7.5 23.88,19.43 22.92,20.4 R55.1
N$151
  Top 0.406: IC7.6 22.61,19.11 21.32,20.4 R60.1
N$152
  Top 0.406: IC7.7 21.34,18.77 19.72,20.4 R58.1
N$163  (via drill 0.6)
  Top 0.406: IC8.15 19.74,40.42 19.32,40 17.32,40 16.91,40.4 v16.91,41.2 | v16.91,36.8 12.82,36.8 R71.1
  Bottom 0.406: v16.91,41.2 v16.91,36.8
N$164
  Top 0.406: IC8.1 14.94,35.73 R68.1
N$166
  Top 0.406: IC8.2 19.74,34.42 19.32,34 16.41,34 R65.1
N$167
  Top 0.406: IC8.3 21.01,34.09 20.12,33.2 18.82,33.2 R62.1
N$168
  Top 0.406: IC8.4 22.28,34.16 21.32,33.2 R59.1
N$169
  Top 0.406: IC8.5 23.55,34.16 24.52,33.2 R56.1
N$170
  Top 0.406: IC8.6 24.82,34.09 25.71,33.2 27.02,33.2 R53.1
N$171
  Top 0.406: IC8.7 26.09,34.42 26.52,34 29.41,34 R50.1
N$179  (via drill 0.6 pad 1.1)
  Top 0.406: IC9.15 14.89,13.18 15.32,13.6 17.72,13.6 18.12,13.2 v18.12,12 | v18.12,17.6 R63.1
  Bottom 0.406: v18.12,12 v18.12,17.6
N$180
  Top 0.406: IC9.1 16.16,20.05 16.52,20.4 R61.1
N$182
  Top 0.406: IC9.2 14.89,21.07 R66.1
N$184
  Top 0.406: IC9.3 13.62,20.09 13.32,20.4 R64.1
N$186
  Top 0.406: IC9.4 12.35,19.77 11.72,20.4 R69.1
N$187
  Top 0.406: IC9.5 11.08,19.43 10.12,20.4 R67.1
N$188
  Top 0.406: IC9.6 9.81,19.11 8.52,20.4 R72.1
N$189
  Top 0.406: IC9.7 8.54,18.77 6.92,20.4 R70.1
N$193
  Top 0.406: IC1.9 71.17,13.74 70.52,14.4 65.72,14.4 64.92,13.6 64.92,11.92 IC3.14
N$194
  Top 0.406: IC3.9 58.47,13.64 57.72,14.4 52.92,14.4 52.12,13.6 52.12,11.82 IC4.14
N$195
  Top 0.406: IC4.9 45.67,13.64 44.92,14.4 40.12,14.4 39.31,13.6 39.31,11.82 IC6.14
N$196
  Top 0.406: IC6.9 32.87,13.64 32.12,14.4 27.32,14.4 26.52,13.6 26.52,11.82 IC7.14
N$197
  Top 0.406: IC7.9 20.07,13.64 19.32,14.4 14.52,14.4 13.72,13.6 13.72,11.82 IC9.14
N$201
  Top 0.406: IC2.14 72.21,40.09 71.31,39.2 54.12,39.2 52.92,40.4 52.92,41.83 IC5.9
N$202
  Top 0.406: IC5.14 46.61,40.09 45.72,39.2 28.52,39.2 27.32,40.4 27.32,41.83 IC8.9
N$203
  Top 0.406: IC8.14 21.01,40.49 19.72,39.2 12.12,39.2 4.92,32 4.92,20 6.12,18.8 6.12,16.4 7.27,15.24 IC9.9
N$205  (via drill 0.6)
  Top 0.406: U1.D11 71.67,4.8 75.72,4.8 76.52,5.6 v76.52,6 | v76.52,9.6 76.92,9.6 77.72,10.4 77.72,11.63 IC1.14
  Bottom 0.406: v76.52,9.6 v76.52,6
N$206
  Top 0.406: U1.D3 46.37,4.8 8.12,4.8 3.32,9.6 3.32,14.4 2.92,14.8 2.92,17.2 1.71,18.4 1.71,34 3.32,35.6 3.32,40.16 S2.1 S2.2
SCK  (via drill 0.6)
  Top 0.406: IC9.11 9.81,9.6 v9.72,9.6 | IC7.11 22.61,9.6 v22.52,9.6 | IC6.11 35.41,9.6 v35.31,9.6 | IC4.11 48.21,9.6 v48.12,9.6 | IC3.11 61.01,9.7 v60.92,9.6 | IC8.11 24.82,43.91 v24.92,44 | IC5.11 50.42,43.91 v50.52,44 | v76.52,47.6 76.52,46.8 76.11,46.4 v50.52,46.4 v24.92,46.4 16.91,46.4 3.32,32.8 3.32,19.2 4.52,18 4.52,15.6 4.92,15.2 4.92,10.4 8.12,7.2 v9.72,7.2 v22.52,7.2 v35.31,7.2 v48.12,7.2 v60.92,7.2 v73.31,7.2 78.11,7.2 78.52,6.8 78.52,5.2 78.11,4.8 76.92,4.8 75.45,3.34 75.45,2.94 U1.D13 | v76.52,44 76.02,43.51 IC2.11 | IC1.11 73.81,10.1 v73.31,9.6
  Bottom 0.406: v73.31,7.2 v73.31,9.6 | v9.72,9.6 v9.72,7.2 | v22.52,9.6 v22.52,7.2 | v35.31,9.6 v35.31,7.2 | v48.12,9.6 v48.12,7.2 | v60.92,9.6 v60.92,7.2 | v24.92,44 v24.92,46.4 | v50.52,44 v50.52,46.4 | v76.52,47.6 v76.52,44
VCC
  Top 0.406: 18.47,43.16 18.47,43.2 | IC6.16 41.76,10.36 41.92,10.2 | 41.92,10.2 42.12,10 46.52,10 46.92,10.4 46.92,11.7 IC4.10 46.94,8.78 47.31,8.4 52.92,8.4 54.72,10.2 | IC7.16 28.96,10.36 29.12,10.2 | 29.12,10.2 29.32,10 33.72,10 34.12,10.4 34.12,11.7 IC6.10 34.14,8.78 34.52,8.4 40.12,8.4 41.92,10.2 | IC4.16 54.56,10.36 54.72,10.2 | 54.72,10.2 54.92,10 59.31,10 59.72,10.4 59.72,11.8 IC3.10 59.74,8.78 60.11,8.4 65.72,8.4 67.52,10.2 | IC3.16 67.36,10.36 67.52,10.2 | 67.52,10.2 67.72,10 70.52,10 71.11,9.4 | 72.52,11.75 IC1.10 72.54,10.82 71.11,9.4 | IC9.16 16.16,10.36 16.32,10.2 | 16.32,10.2 16.52,10 20.91,10 21.32,10.4 21.32,11.7 IC7.10 21.34,8.78 21.71,8.4 27.32,8.4 29.12,10.2 | 8.52,11.7 IC9.10 8.54,9.73 | IC8.10 26.09,43.17 26.52,43.6 | 26.52,43.6 43.72,43.6 44.12,43.2 | IC5.16 44.12,41.92 44.12,43.2 | IC5.10 51.69,43.17 52.12,43.6 | 52.12,43.6 69.31,43.6 69.72,43.2 | 69.72,43.2 69.72,41.92 IC2.16 | 8.54,9.73 8.54,8.78 8.92,8.4 14.52,8.4 16.32,10.2 | IC8.16 18.47,42.4 | 18.47,42.4 18.47,43.16 | 18.47,43.16 20.52,45.2 25.71,45.2 26.52,44.4 26.52,43.6 | 44.12,43.2 46.12,45.2 51.31,45.2 52.12,44.4 52.12,43.6 | U1.VIN 58.39,49.73 59.72,48.4 73.72,48.4 74.11,48.8 77.31,48.8 78.11,48 78.11,46.4 77.31,45.6 | 77.31,45.6 72.11,45.6 69.72,43.2 | 10.12,26.8 6.92,26.8 6.95,26.84 LED24.A | 10.12,26.8 13.32,26.8 | 13.32,26.8 16.52,26.8 | 16.52,26.8 19.72,26.8 | 19.72,26.8 22.92,26.8 | 22.92,26.8 26.12,26.8 | 26.12,26.8 29.32,26.8 | 29.32,26.8 32.52,26.8 | 32.52,26.8 35.72,26.8 | 35.72,26.8 38.91,26.8 | 38.91,26.8 42.12,26.8 | 42.12,26.8 45.31,26.8 | 45.31,26.8 48.52,26.8 | 48.52,26.8 51.72,26.8 | 51.72,26.8 54.92,26.8
  Top 0.406: 54.92,26.8 58.11,26.8 | 58.11,26.8 61.31,26.8 | 61.31,26.8 64.52,26.8 | 64.52,26.8 67.72,26.8 | 67.72,26.8 70.92,26.8 | 70.92,26.8 74.11,26.8 | 74.11,26.8 77.31,26.8 | 77.31,26.8 80.52,26.8 | 80.52,26.8 82.92,26.8 83.72,26 83.72,20.4 82.52,19.2 82.52,15.2 80.11,12.8 80.11,11.77 IC1.16 80.11,11.68 80.11,10 78.52,8.4 72.11,8.4 71.11,9.4 | LED23.A 10.15,26.84 10.12,26.8 | LED22.A 13.35,26.84 13.32,26.8 | LED21.A 16.55,26.84 16.52,26.8 | LED20.A 19.75,26.84 19.72,26.8 | LED19.A 22.95,26.84 22.92,26.8 | LED18.A 26.15,26.84 26.12,26.8 | LED17.A 29.35,26.84 29.32,26.8 | LED16.A 32.55,26.84 32.52,26.8 | LED15.A 35.75,26.84 35.72,26.8 | LED14.A 38.95,26.84 38.91,26.8 | LED13.A 42.15,26.84 42.12,26.8 | LED12.A 45.35,26.84 45.31,26.8 | LED11.A 48.55,26.84 48.52,26.8 | LED10.A 51.75,26.84 51.72,26.8 | LED9.A 54.95,26.84 54.92,26.8 | LED8.A 58.15,26.84 58.11,26.8 | LED7.A 61.35,26.84 61.31,26.8 | LED6.A 64.55,26.84 64.52,26.8 | LED5.A 67.75,26.84 67.72,26.8 | LED4.A 70.95,26.84 70.92,26.8 | LED3.A 74.15,26.84 74.11,26.8 | LED2.A 77.35,26.84 77.31,26.8 | LED1.A 80.55,26.84 80.52,26.8 | 8.54,9.73 6.79,9.73 5.71,10.8 5.71,15.6 5.32,16 5.32,18.4 4.12,19.6 4.12,32.4 14.12,42.4 18.47,42.4 | IC2.10 77.29,42.77 77.72,43.2 77.72,45.2 77.31,45.6